# EAGLE design 4-20mA-generator (EAGLE 7.4.0)
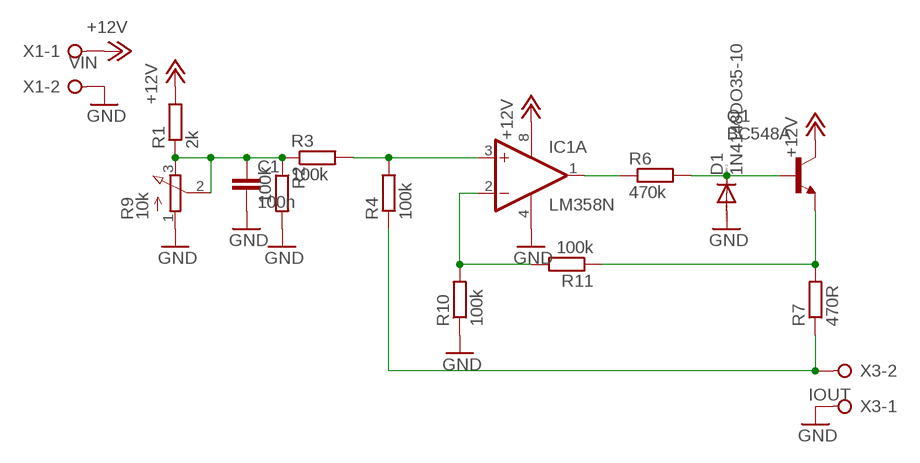
[diagram p0: schematic, sheet 1]

## Parts
C1  100n  C-EU050-024X044  [C050-024X044]
D1  1N4148DO35-10  [DO35-10]
IC1  LM358N  [DIL08]
Q1  BC548A  [TO92-EBC]
R1  2k  R-EU_0207/7  [0207/7]
R2  100k  R-EU_0207/7  [0207/7]
R3  100k  R-EU_0207/7  [0207/7]
R4  100k  R-EU_0207/7  [0207/7]
R6  470k  R-EU_0207/7  [0207/7]
R7  470R  R-EU_0207/7  [0207/7]
R9  10k  3RP/1610N  [3RP/1610N]
R10  100k  R-EU_0207/7  [0207/7]
R11  100k  R-EU_0207/7  [0207/7]
X1  VIN  W237-02P  [W237-132]
X3  IOUT  W237-02P  [W237-132]

## Nets
+12V: IC1.8(P:V+) Q1.C R1.2 X1.1
GND: C1.2 D1.A IC1.4(P:V-) R2.2 R9.1(A) R10.1 X1.2 X3.1
N$1: C1.1 R1.1 R2.1 R3.1 R9.2(S) R9.3(E)
N$3: IC1.2(A:-IN) R10.2 R11.2
N$4: IC1.1(A:OUT) R6.1
N$5: D1.C Q1.B R6.2
N$6: Q1.E R7.2 R11.1
N$7: R4.1 R7.1 X3.2
N$8: IC1.3(A:+IN) R3.2 R4.2
Unconnected: IC1.5(B:+IN) IC1.6(B:-IN) IC1.7(B:OUT)

## Library data of the parts
C1 = rcl:C-EU: CAPACITOR, European symbol
D1 = diode:1N4148: DIODE high speed (Philips)
IC1 = linear:LM358: OP AMP also LM158; LM258; LM2904 Source: http://cache.national.com/ds/LM/LM158.pdf
Q1 = transistor-npn:BC548*: NPN Transistor
R1-R4 R6 R7 R10 R11 = rcl:R-EU_: RESISTOR, European symbol
R9 = pot:3RP/1610N: 16mm Potentiometer one level Source: http://www.alphapotentiometers.net/html/16mm_pot_2.html
X1 X3 = con-wago-508:W237-02P: WAGO SREW CLAMP; OC_FARNELL: unknown; OC_NEWARK: unknown

## Board
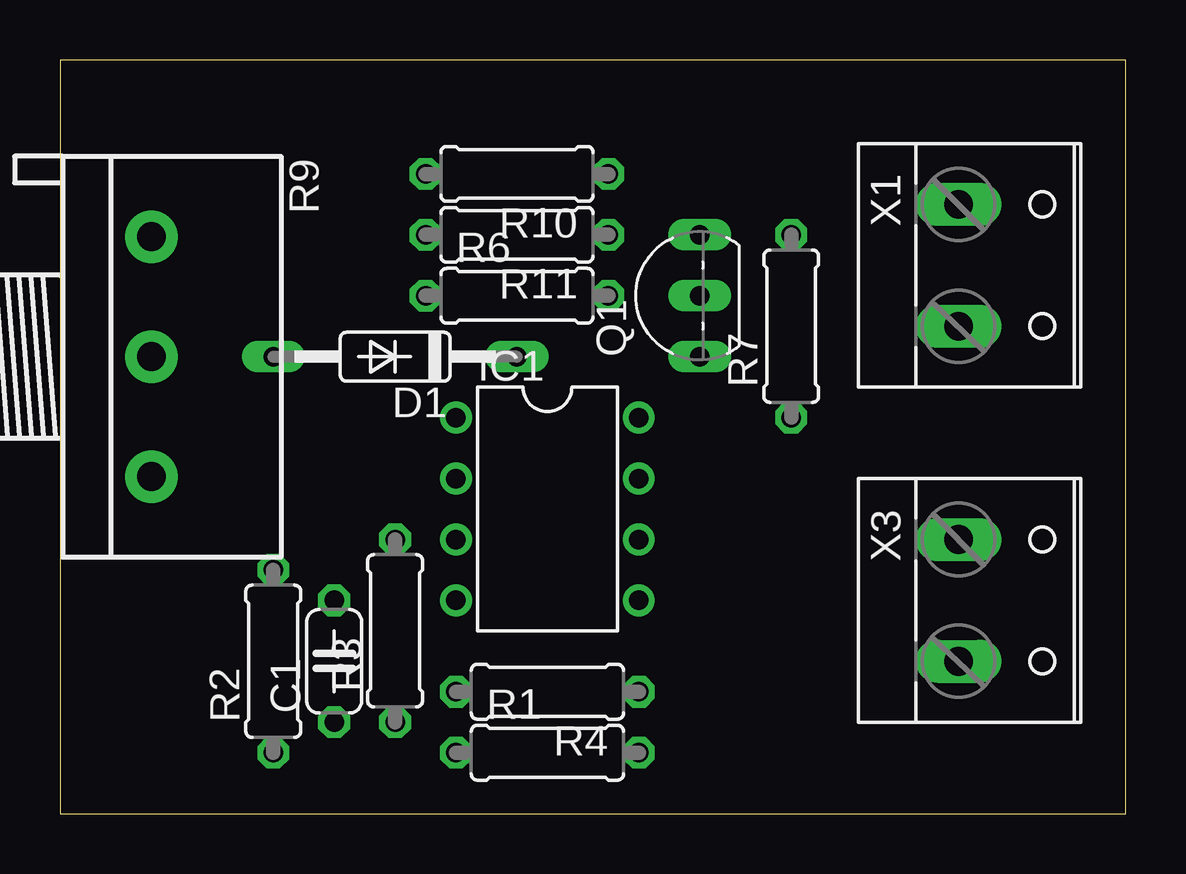
[diagram p1: board, top side]
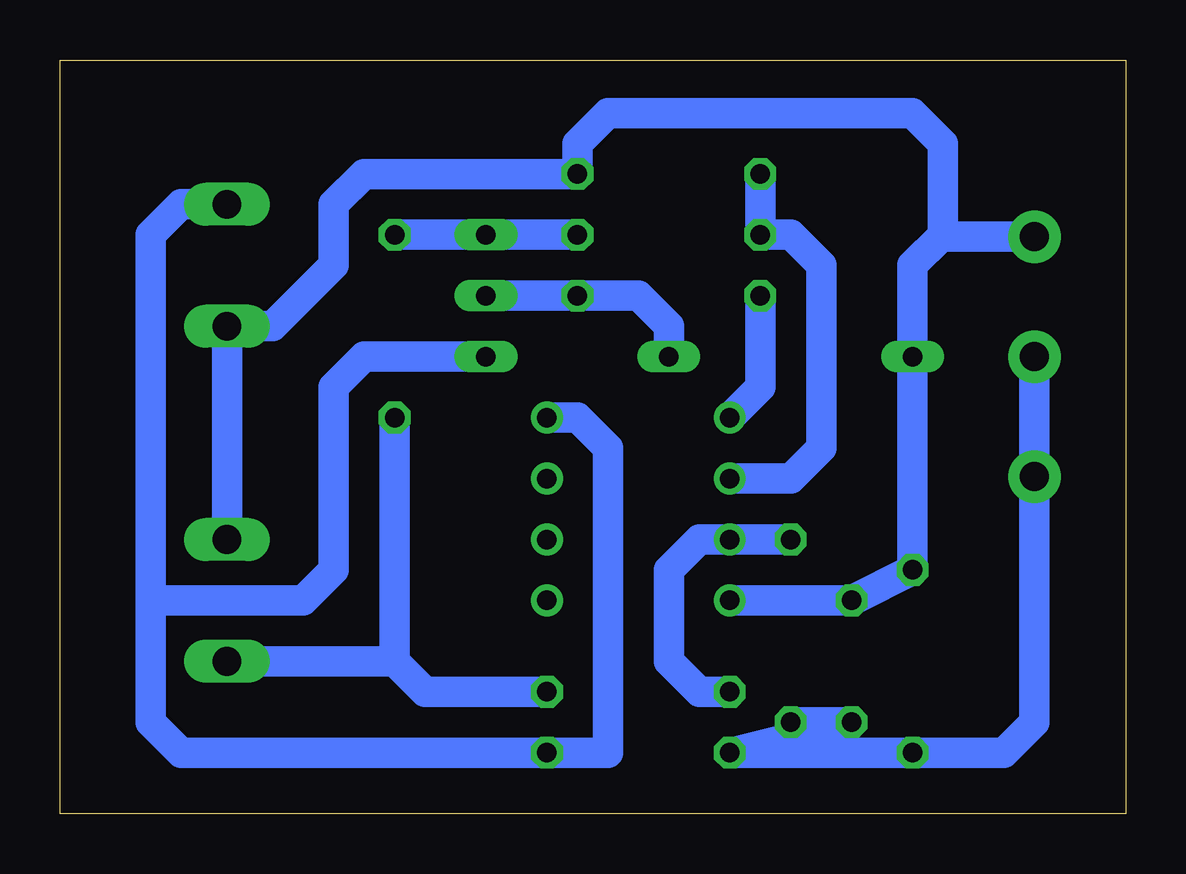
[diagram p2: board, bottom side, seen from below]

Size 44.43 x 31.42 mm. Coordinates in mm from the lower left corner, seen from the top.
Outline: 0,0 44.43,0 44.43,31.42 0,31.42 0,0
Copper layers (1*16): Top 0.035mm / dielectric 1.5mm / Bottom 0.035mm
Design rules "default": minimum track width 10mil, minimum drill 24mil, track to track 8mil, track to pad 8mil, pad to pad 8mil, via to via 8mil, smd to smd 8mil, copper to edge 40mil, drill to drill 8mil, minimum pad ring 10mil, minimum via ring 8mil, stop-mask expansion 4mil, vias tented up to drill 0mil, thermal gap 10mil

### Footprints (pad centres in the part's own frame; a part is rotated, then mirrored left to right if it is on the bottom)
C050-024X044 = drill 0.813 octagon: 1 -2.54,0; 2 2.54,0
DO35-10 = drill 0.813 long: A 5.08,0; C -5.08,0
DIL08 = drill 0.813 pad 1.27: 1 -3.81,-3.81; 2 -1.27,-3.81; 3 1.27,-3.81; 4 3.81,-3.81; 5 3.81,3.81; 6 1.27,3.81; 7 -1.27,3.81; 8 -3.81,3.81
TO92-EBC = drill 0.813 long: B 0,-1.27; C -2.54,-1.27; E 2.54,-1.27
0207/7 = drill 0.813 octagon: 1 -3.81,0; 2 3.81,0
3RP/1610N = drill 1.2 pad 2.184: 1 -5,0; 2 0,0; 3 5,0
W237-132 = drill 1.194 long: 1 -2.54,-0.635; 2 2.54,-0.635

### Placement (x,y rotation side)
C1  11.43,6.35 90 top
D1  13.97,19.05 180 top
IC1  20.32,12.7 270 top
Q1  25.4,21.59 90 top
R1  20.32,2.54 0 top
R2  8.89,6.35 90 top
R3  13.97,7.62 90 top
R4  20.32,5.08 180 top
R6  19.05,21.59 0 top
R7  30.48,20.32 90 top
R9  3.81,19.05 270 top
R10  19.05,26.67 180 top
R11  19.05,24.13 180 top
X1  38.1,22.86 270 top
X3  38.1,8.89 270 top

### Tracks (layer width: path | path; a pad name or v marks a point on that pad's centre or on a via)
+12V
  Bottom 1.27: IC1.8 22.86,16.51 21.59,15.24 21.59,2.54 R1.2 39.37,2.54 40.64,3.81 40.64,8.89 | X1.1 39.37,25.4 40.64,24.13 40.64,8.89 | Q1.C 31.75,19.05 33.02,17.78 33.02,10.16 34.29,8.89 40.64,8.89
GND
  Bottom 1.27: R9.1 7.62,24.05 | 7.62,24.05 7.7,24.05 8.89,22.86 D1.A R2.2 C1.2 IC1.4 | X3.1 X1.2 35.56,20.32 33.02,22.86 33.02,25.4 31.75,26.67 R10.1 22.86,27.94 21.59,29.21 8.89,29.21 7.62,27.94 7.62,24.05
N$1
  Bottom 1.27: R3.1 C1.1 R1.1 | R1.1 R2.1 | R1.1 5.08,2.54 3.81,3.81 R9.3 R9.2
N$3
  Bottom 1.27: IC1.2 13.97,13.97 12.7,15.24 12.7,22.86 13.97,24.13 R11.2 R10.2
N$4
  Bottom 1.27: R6.1 15.24,17.78 IC1.1
N$5
  Bottom 1.27: Q1.B R6.2 20.32,21.59 19.05,20.32 D1.C
N$6
  Bottom 1.27: R11.1 Q1.E R7.2
N$7
  Bottom 1.27: R4.1 29.21,5.08 30.48,6.35 | 30.48,6.35 X3.2 | R7.1 30.48,6.35
N$8
  Bottom 1.27: R3.2 IC1.3 17.78,11.43 19.05,10.16 19.05,6.35 17.78,5.08 R4.2